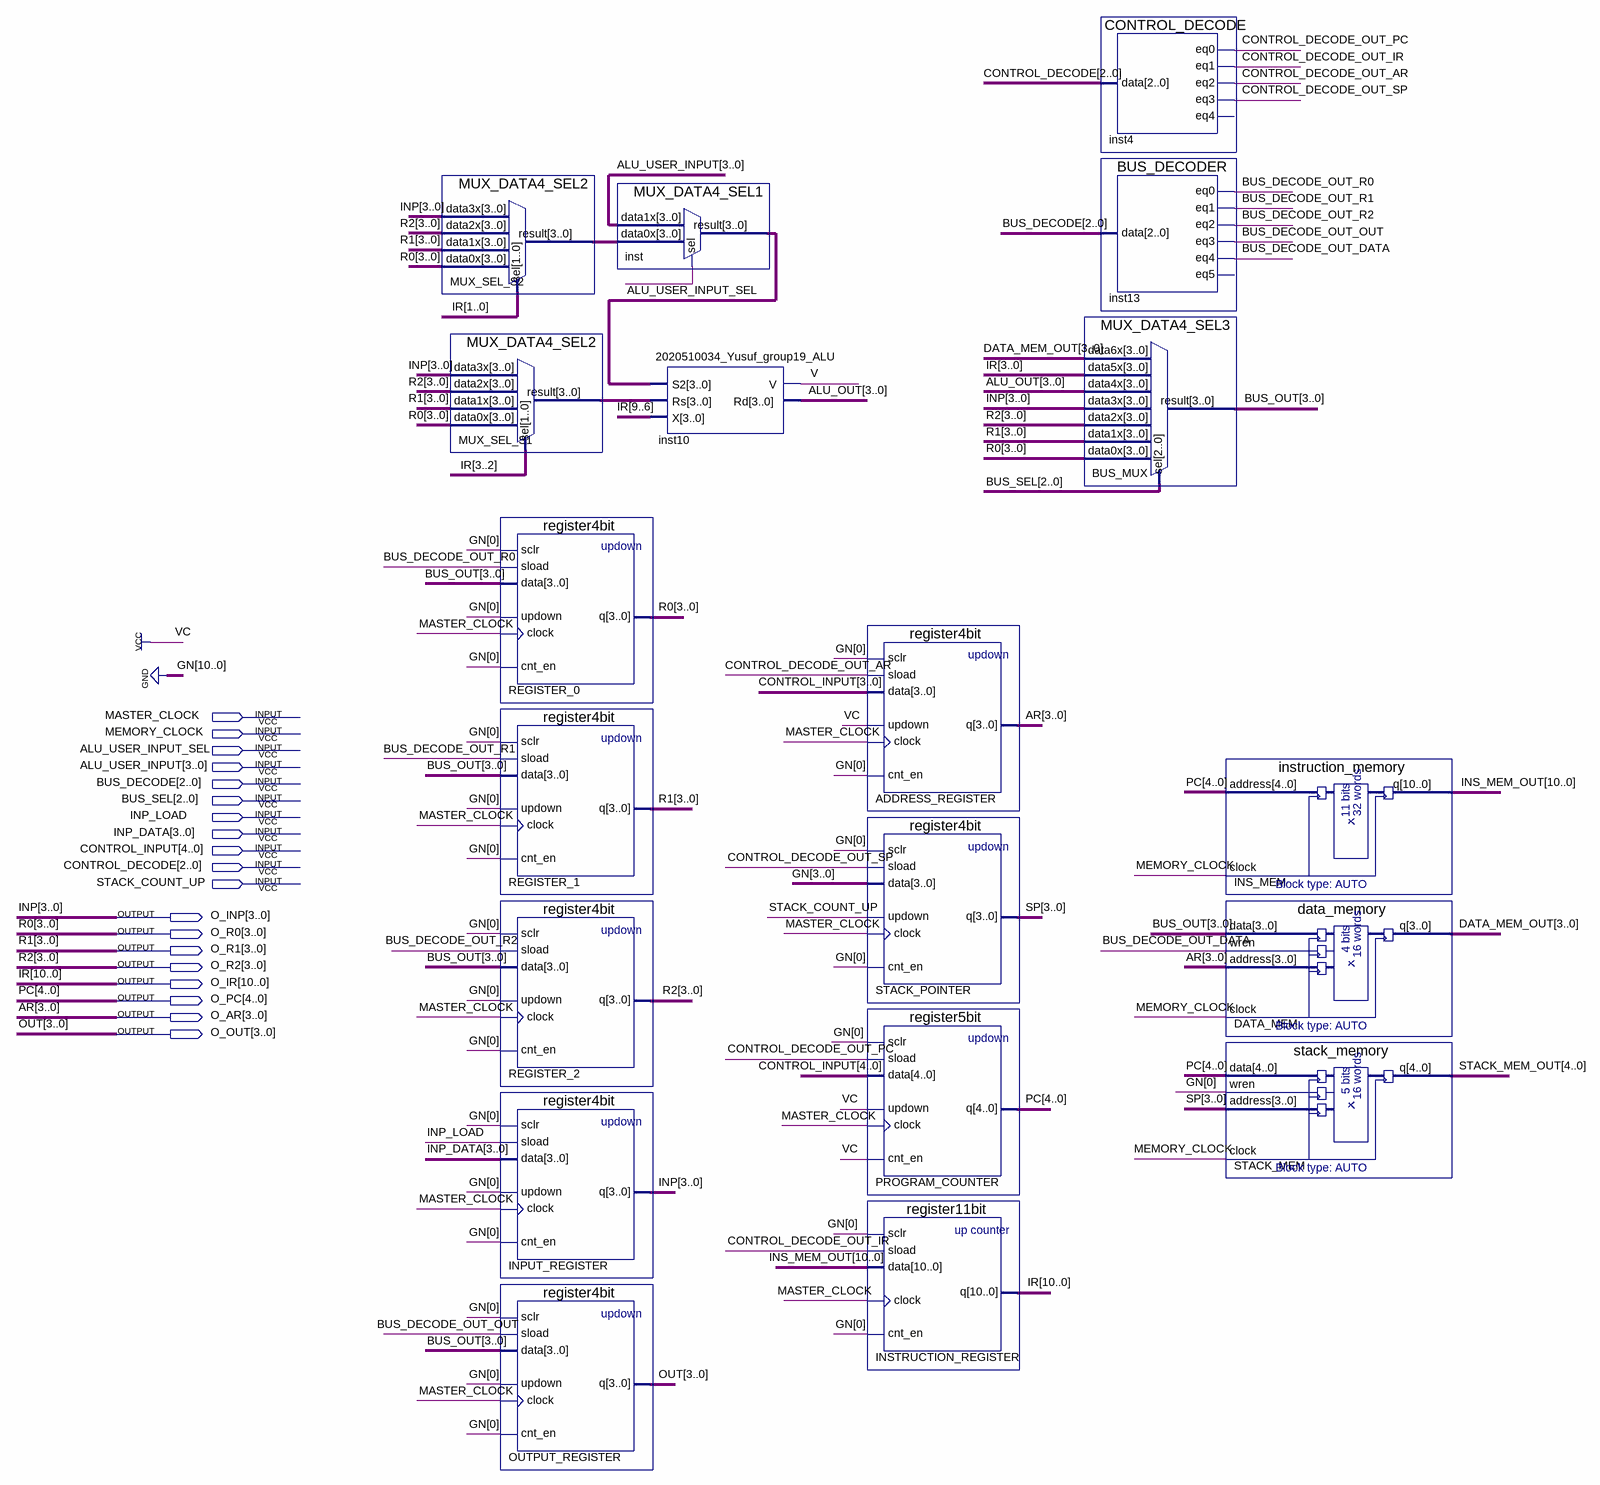
[diagram p0: schematic sheet]
// Quartus schematic 2020510030_Berkay-Dinc_Group19_Lab5_Project_BUS.bdf as structural Verilog: 19 symbols, 19 pins
module \2020510030_Berkay-Dinc_Group19_Lab5_Project_BUS  (
  input  MASTER_CLOCK,
  input  MEMORY_CLOCK,
  input  ALU_USER_INPUT_SEL,
  input  [3:0] ALU_USER_INPUT,
  input  [2:0] BUS_DECODE,
  input  [2:0] BUS_SEL,
  input  INP_LOAD,
  input  [3:0] INP_DATA,
  input  [4:0] CONTROL_INPUT,
  input  [2:0] CONTROL_DECODE,
  input  STACK_COUNT_UP,
  output [3:0] O_INP,
  output [3:0] O_R0,
  output [3:0] O_R1,
  output [3:0] O_R2,
  output [10:0] O_IR,
  output [4:0] O_PC,
  output [3:0] O_AR,
  output [3:0] O_OUT
);

  wire BUS_DECODE_OUT_DATA, BUS_DECODE_OUT_OUT, BUS_DECODE_OUT_R0, BUS_DECODE_OUT_R1, BUS_DECODE_OUT_R2,
       CONTROL_DECODE_OUT_AR, CONTROL_DECODE_OUT_IR, CONTROL_DECODE_OUT_PC, CONTROL_DECODE_OUT_SP, V;
  wire [3:0] ALU_OUT, BUS_OUT, DATA_MEM_OUT, inst_result, MUX_SEL_S1_result, MUX_SEL_S2_result, SP;
  wire [4:0] STACK_MEM_OUT;
  wire [10:0] INS_MEM_OUT;

  MUX_DATA4_SEL2 MUX_SEL_S2 (
    .data3x(O_INP), .data2x(O_R2), .data1x(O_R1), .data0x(O_R0), .sel(O_IR[1:0]), .result(MUX_SEL_S2_result));
  MUX_DATA4_SEL2 MUX_SEL_S1 (
    .data3x(O_INP), .data2x(O_R2), .data1x(O_R1), .data0x(O_R0), .sel(O_IR[3:2]), .result(MUX_SEL_S1_result));
  register4bit REGISTER_0 (
    .sclr(1'b0), .sload(BUS_DECODE_OUT_R0), .data(BUS_OUT), .updown(1'b0), .clock(MASTER_CLOCK),
    .cnt_en(1'b0), .q(O_R0));
  register4bit REGISTER_1 (
    .sclr(1'b0), .sload(BUS_DECODE_OUT_R1), .data(BUS_OUT), .updown(1'b0), .clock(MASTER_CLOCK),
    .cnt_en(1'b0), .q(O_R1));
  register4bit REGISTER_2 (
    .sclr(1'b0), .sload(BUS_DECODE_OUT_R2), .data(BUS_OUT), .updown(1'b0), .clock(MASTER_CLOCK),
    .cnt_en(1'b0), .q(O_R2));
  register4bit INPUT_REGISTER (
    .sclr(1'b0), .sload(INP_LOAD), .data(INP_DATA), .updown(1'b0), .clock(MASTER_CLOCK), .cnt_en(1'b0),
    .q(O_INP));
  register4bit OUTPUT_REGISTER (
    .sclr(1'b0), .sload(BUS_DECODE_OUT_OUT), .data(BUS_OUT), .updown(1'b0), .clock(MASTER_CLOCK),
    .cnt_en(1'b0), .q(O_OUT));
  MUX_DATA4_SEL1 inst (
    .data1x(ALU_USER_INPUT), .data0x(MUX_SEL_S2_result), .sel(ALU_USER_INPUT_SEL), .result(inst_result));
  \2020510034_Yusuf_group19_ALU  inst10 (.S2(inst_result), .Rs(MUX_SEL_S1_result), .X(O_IR[9:6]), .V(V), .Rd(ALU_OUT));
  register4bit ADDRESS_REGISTER (
    .sclr(1'b0), .sload(CONTROL_DECODE_OUT_AR), .data(CONTROL_INPUT[3:0]), .updown(1'b1),
    .clock(MASTER_CLOCK), .cnt_en(1'b0), .q(O_AR));
  register4bit STACK_POINTER (
    .sclr(1'b0), .sload(CONTROL_DECODE_OUT_SP), .data(4'b0000), .updown(STACK_COUNT_UP),
    .clock(MASTER_CLOCK), .cnt_en(1'b0), .q(SP));
  register5bit PROGRAM_COUNTER (
    .sclr(1'b0), .sload(CONTROL_DECODE_OUT_PC), .data(CONTROL_INPUT), .updown(1'b1), .clock(MASTER_CLOCK),
    .cnt_en(1'b1), .q(O_PC));
  register11bit INSTRUCTION_REGISTER (
    .sclr(1'b0), .sload(CONTROL_DECODE_OUT_IR), .data(INS_MEM_OUT), .clock(MASTER_CLOCK), .cnt_en(1'b0),
    .q(O_IR));
  CONTROL_DECODE inst4 (
    .data(CONTROL_DECODE), .eq0(CONTROL_DECODE_OUT_PC), .eq1(CONTROL_DECODE_OUT_IR),
    .eq2(CONTROL_DECODE_OUT_AR), .eq3(CONTROL_DECODE_OUT_SP));  // open: eq4
  BUS_DECODER inst13 (
    .data(BUS_DECODE), .eq0(BUS_DECODE_OUT_R0), .eq1(BUS_DECODE_OUT_R1), .eq2(BUS_DECODE_OUT_R2),
    .eq3(BUS_DECODE_OUT_OUT), .eq4(BUS_DECODE_OUT_DATA));  // open: eq5
  MUX_DATA4_SEL3 BUS_MUX (
    .data6x(DATA_MEM_OUT), .data5x(O_IR[3:0]), .data4x(ALU_OUT), .data3x(O_INP), .data2x(O_R2),
    .data1x(O_R1), .data0x(O_R0), .sel(BUS_SEL), .result(BUS_OUT));
  instruction_memory INS_MEM (.address(O_PC), .clock(MEMORY_CLOCK), .q(INS_MEM_OUT));
  data_memory DATA_MEM (
    .data(BUS_OUT), .wren(BUS_DECODE_OUT_DATA), .address(O_AR), .clock(MEMORY_CLOCK), .q(DATA_MEM_OUT));
  stack_memory STACK_MEM (.data(O_PC), .wren(1'b0), .address(SP), .clock(MEMORY_CLOCK), .q(STACK_MEM_OUT));

  // Other names for the same wires on the sheet: AR[3:0] = O_AR; INP[3:0] = O_INP; IR[10:0] = O_IR; OUT[3:0] = O_OUT;
  //   PC[4:0] = O_PC; R0[3:0] = O_R0; R1[3:0] = O_R1; R2[3:0] = O_R2
endmodule
